# Altium schematic sheet Amp_op.SchDoc
size A0; SheetNumber: 4; SheetTotal: 4
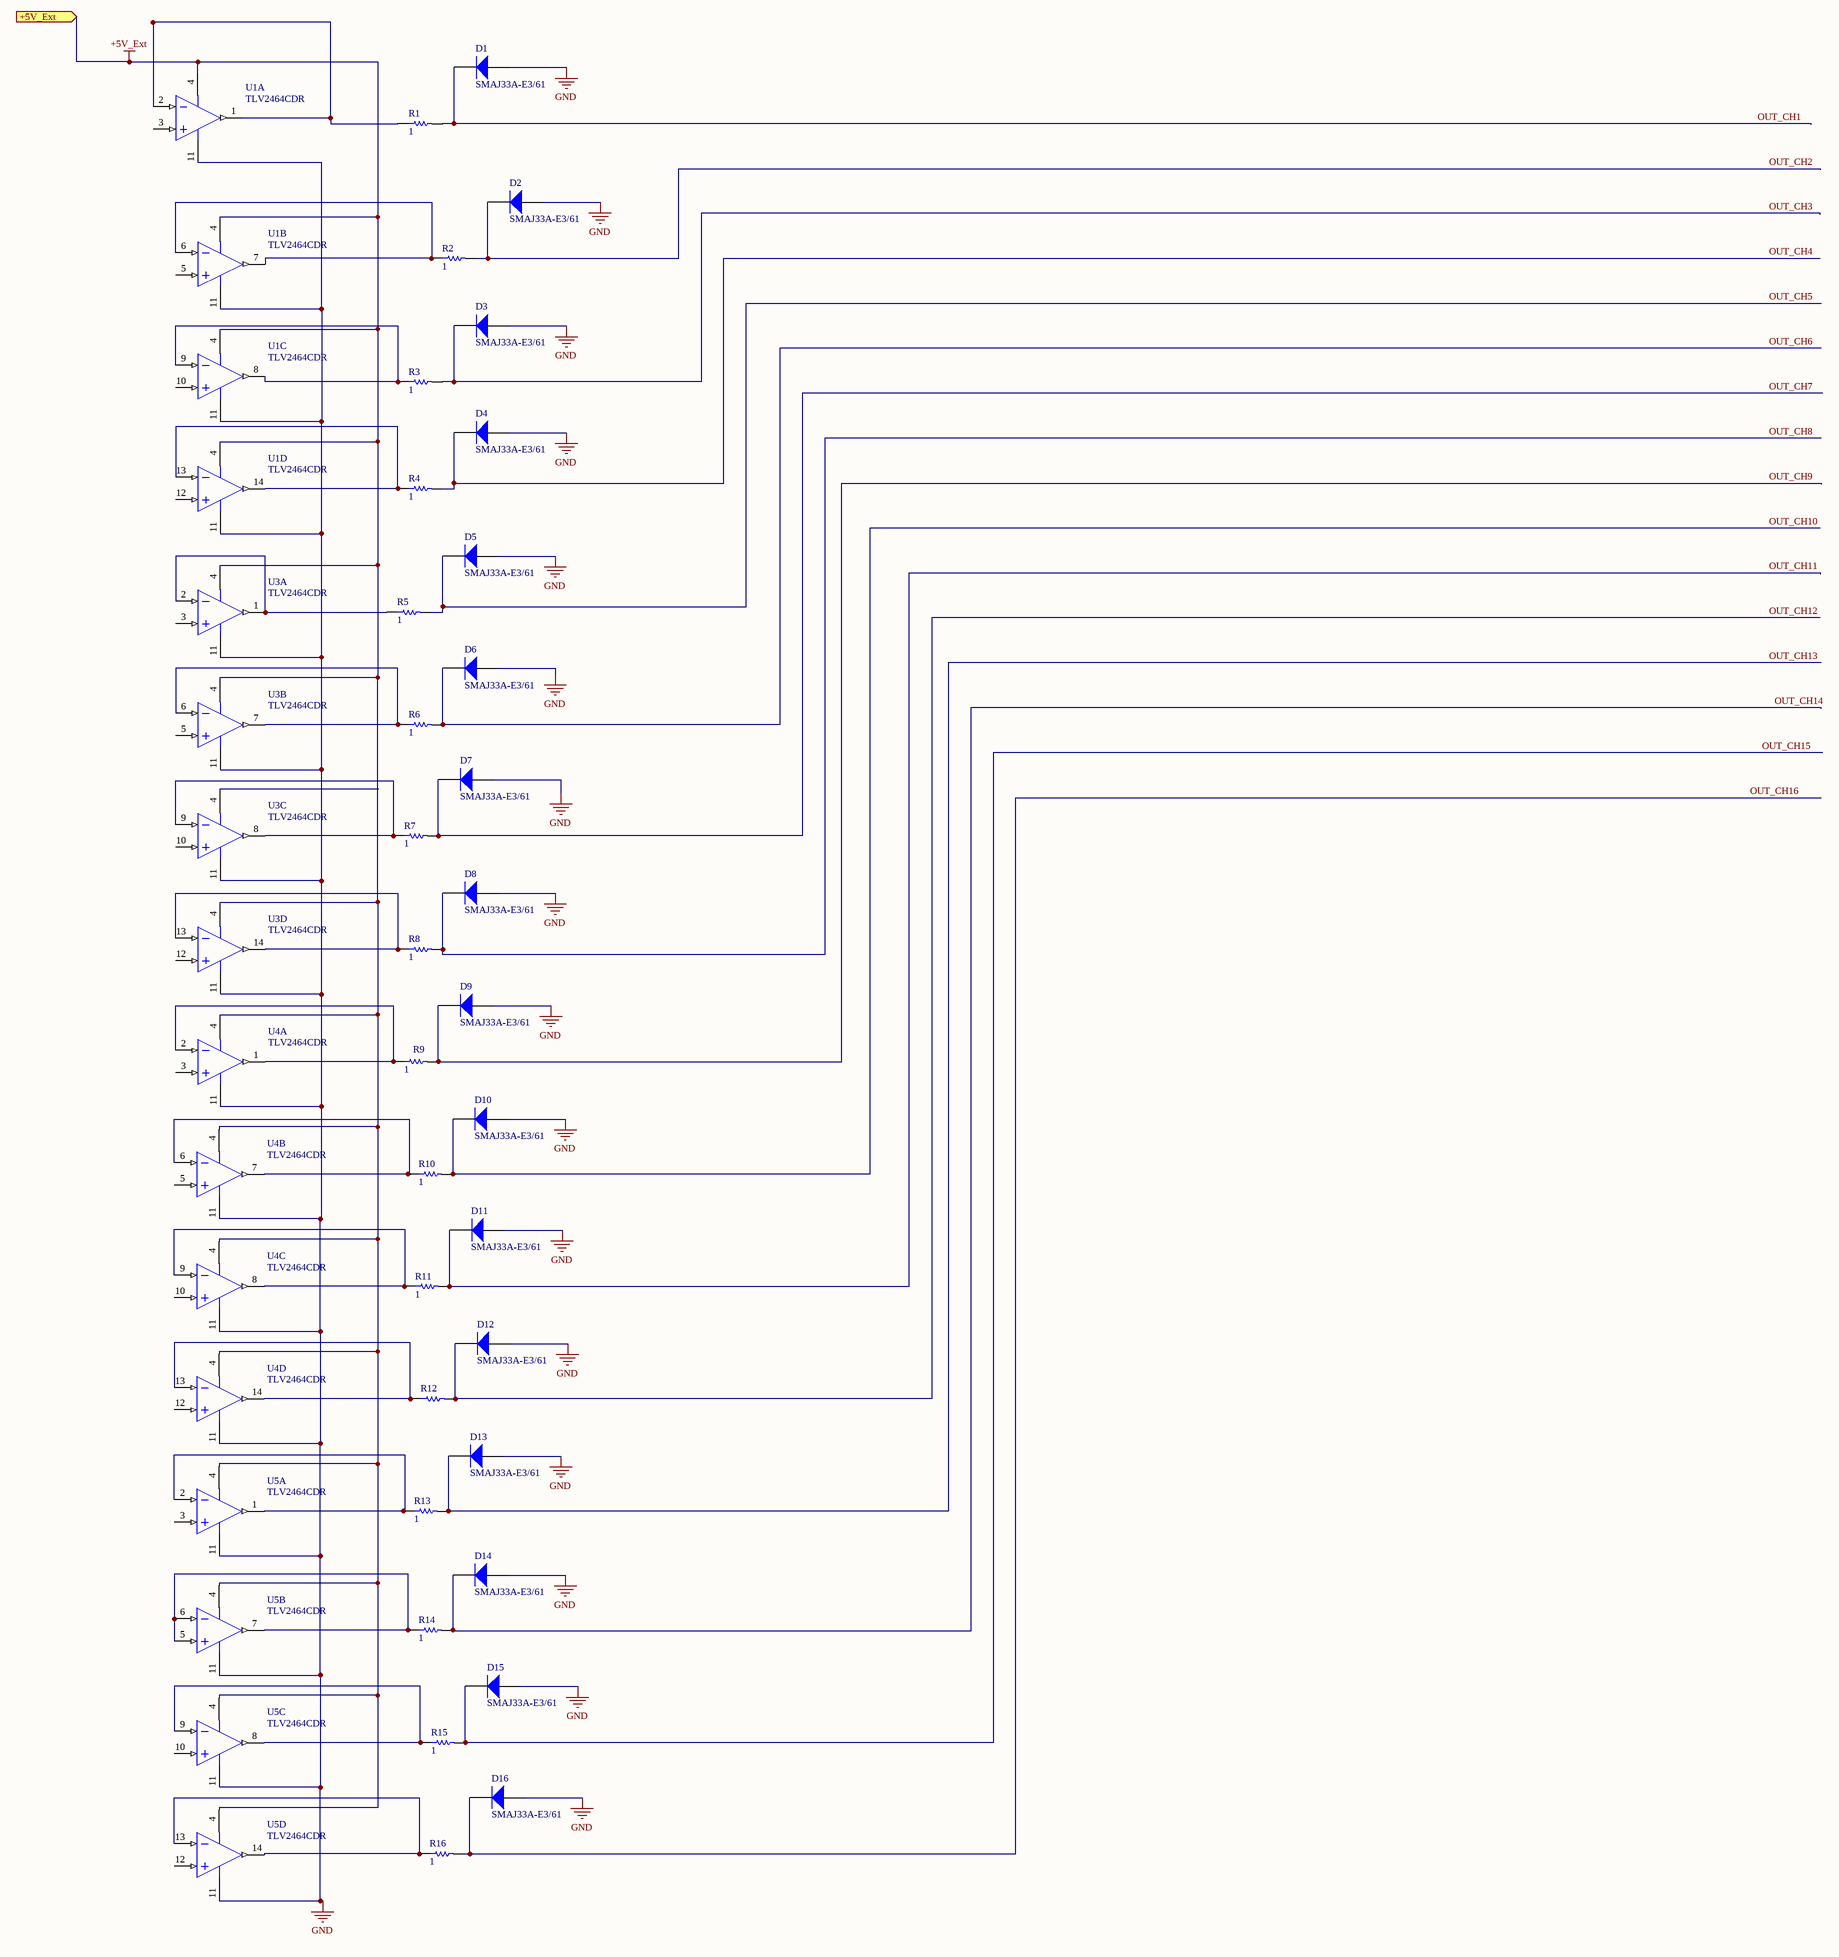
[diagram p0: Amp_op.SchDoc]

## Parts
D1  SMAJ33A-E3/61  [VISH-DO-214AC-2_L]
D2  SMAJ33A-E3/61  [VISH-DO-214AC-2_L]
D3  SMAJ33A-E3/61  [VISH-DO-214AC-2_L]
D4  SMAJ33A-E3/61  [VISH-DO-214AC-2_L]
D5  SMAJ33A-E3/61  [VISH-DO-214AC-2_L]
D6  SMAJ33A-E3/61  [VISH-DO-214AC-2_L]
D7  SMAJ33A-E3/61  [VISH-DO-214AC-2_L]
D8  SMAJ33A-E3/61  [VISH-DO-214AC-2_L]
D9  SMAJ33A-E3/61  [VISH-DO-214AC-2_L]
D10  SMAJ33A-E3/61  [VISH-DO-214AC-2_L]
D11  SMAJ33A-E3/61  [VISH-DO-214AC-2_L]
D12  SMAJ33A-E3/61  [VISH-DO-214AC-2_L]
D13  SMAJ33A-E3/61  [VISH-DO-214AC-2_L]
D14  SMAJ33A-E3/61  [VISH-DO-214AC-2_L]
D15  SMAJ33A-E3/61  [VISH-DO-214AC-2_L]
D16  SMAJ33A-E3/61  [VISH-DO-214AC-2_L]
R1  value 1  (hidden comment: Resistor)
R2  value 1  (hidden comment: Resistor)
R3  value 1  (hidden comment: Resistor)
R4  value 1  (hidden comment: Resistor)
R5  value 1  (hidden comment: Resistor)
R6  value 1  (hidden comment: Resistor)
R7  value 1  (hidden comment: Resistor)
R8  value 1  (hidden comment: Resistor)
R9  value 1  (hidden comment: Resistor)
R10  value 1  (hidden comment: Resistor)
R11  value 1  (hidden comment: Resistor)
R12  Resistor  (value not drawn)
R13  value 1  (hidden comment: Resistor)
R14  value 1  (hidden comment: Resistor)
R15  value 1  (hidden comment: Resistor)
R16  value 1  (hidden comment: Resistor)
U1  TLV2464CDR  [D0014A_N]  (parts A,B,C,D of 4)
U3  TLV2464CDR  [D0014A_N]  (parts A,B,C,D of 4)
U4  TLV2464CDR  [D0014A_N]  (parts A,B,C,D of 4)
U5  TLV2464CDR  [D0014A_N]  (parts A,B,C,D of 4)

## Ports
+5V_Ext (in)

## Nets
+5V_Ext: U1.4(VDD+) U3.4(VDD+) U4.4(VDD+) U5.4(VDD+) ; port +5V_Ext
GND: D1.2(A) D2.2(A) D3.2(A) D4.2(A) D5.2(A) D6.2(A) D7.2(A) D8.2(A) D9.2(A) D10.2(A) D11.2(A) D12.2(A) D13.2(A) D14.2(A) D15.2(A) D16.2(A) U3.11(GND) U4.11(GND) U5.11(GND)
OUT_CH1: D1.1(K) R1.2
OUT_CH2: D2.1(K) R2.2
OUT_CH3: D3.1(K) R3.2
OUT_CH4: D4.1(K) R4.2
OUT_CH5: D5.1(K) R5.2
OUT_CH6: D6.1(K) R6.2
OUT_CH7: D7.1(K) R7.2
OUT_CH8: D8.1(K) R8.2
OUT_CH9: D9.1(K) R9.2
OUT_CH10: D10.1(K) R10.2
OUT_CH11: D11.1(K) R11.2
OUT_CH12: D12.1(K) R12.2
OUT_CH13: D13.1(K) R13.2
OUT_CH14: D14.1(K) R14.2
OUT_CH15: D15.1(K) R15.2
OUT_CH16: D16.1(K) R16.2
NetR1_1: R1.1 U1.1(OUT1) U1.2(IN1-)
NetR2_1: R2.1 U1.6(IN2-) U1.7(OUT2)
NetR3_1: R3.1 U1.8(OUT3) U1.9(IN3-)
NetR4_1: R4.1 U1.13(IN4-) U1.14(OUT4)
NetR5_1: R5.1 U3.1(OUT1) U3.2(IN1-)
NetR6_1: R6.1 U3.6(IN2-) U3.7(OUT2)
NetR7_1: R7.1 U3.8(OUT3) U3.9(IN3-)
NetR8_1: R8.1 U3.13(IN4-) U3.14(OUT4)
NetR9_1: R9.1 U4.1(OUT1) U4.2(IN1-)
NetR10_1: R10.1 U4.6(IN2-) U4.7(OUT2)
NetR11_1: R11.1 U4.8(OUT3) U4.9(IN3-)
NetR12_1: R12.1 U4.13(IN4-) U4.14(OUT4)
NetR13_1: R13.1 U5.1(OUT1) U5.2(IN1-)
NetR14_1: R14.1 U5.5(IN2+) U5.6(IN2-) U5.7(OUT2)
NetR15_1: R15.1 U5.8(OUT3) U5.9(IN3-)
NetR16_1: R16.1 U5.13(IN4-) U5.14(OUT4)
NetU1_11: U1.11(GND) U3.11(GND)

Not connected (* = marked no-connect by the designer): U1 3(IN1+) 5(IN2+) 10(IN3+) 12(IN4+); U3 3(IN1+) 5(IN2+) 10(IN3+) 12(IN4+); U4 3(IN1+) 5(IN2+) 10(IN3+) 12(IN4+); U5 3(IN1+) 10(IN3+) 12(IN4+)

## Library data of the parts
D1-D16 = CMP-0548-00255-2: Transient Voltage Suppressor, 6.40 to 231 V, 33 V Stand-off Voltage, Uni-Directional, -55 to 155 degC, 2-pin DO-214AC, Pb-Free, Tape and Reel; Manufacturer: Vishay Semiconductor; VBR Uni-Directional (V): 6.4 to 231; ID (uA): 1; IFSM: 40 A; VWM (V): 33; PPPM (W): 400, 300; ComponentLink2Description: Datasheet; RoHS: TRUE; Mounting Technology: Surface Mount; ComponentLink2URL: http://www.vishay.com/docs/88390/smaj50a.pdf; PackageDescription: 2-Pin DO-214AC (SMA), Body 4.245 x 2.665 mm; PartNumber: SMAJ33A-E3/61; DatasheetVersion: 12/8/2013; ComponentLink1URL: http://www.vishay.com/; ComponentLink3Description: Package Specification; PackageReference: DO-214AC-2; ComponentLink3URL: http://www.vishay.com/docs/88390/smaj50a.pdf; ComponentLink1Description: Manufacturer URL; Operating Junction and Storage Temperature Range: -55 to 150 degC; Packing: Tape and Reel
R1-R16 = Resistor: TC1: 0; SimulationGenericComponent: True; TC2: 0
U1 U3-U5 = CMP-0271-00006-3: Quad Low Power, Rail-to-Rail Input / Output Operational Amplifier, 2.7 to 6 V, 0 to 70 degC, 14-pin SOIC (D14), Green (RoHS & no Sb/Br); Manufacturer: Texas Instruments; Offset Drift(Typ)(uV/C): 2; Total Supply Voltage(Min)(+5V is 5, +/-5V is 10): 2.7; IIB(Max)(pA): 14000; CMRR(Min)(dB): 66; Iq per channel(Max)(mA): 0.575; Vn at 1kHz(Typ)(nV/rtHz): 11; Slew Rate(Typ)(V/us): 1.6; Number of Channels: 4; Sub Family: High Output Current Amplifier (>=50mA), Low Supply Voltage Amplifier (<=2.7V), Precision Amplifier; Total Supply Voltage(Max)(+5V is 5, +/-5V is 10): 6; ComponentLink3URL: http://www.ti.com/lit/ml/mpds177g/mpds177g.pdf; ComponentLink1Description: Manufacturer URL; PackageReference: D0014A; Vio (25C)(Max)(mV): 2; Mounting Technology: Surface Mount; PackageDescription: 14-Pin Plastic Small Outline, Body 8.65 x 3.9 mm, Pitch 1.27 mm; ComponentLink2Description: Datasheet; ComponentLink3Description: Package Specification; ComponentLink1URL: http://www.ti.com/; DatasheetVersion: SLOS220J; PartNumber: TLV2464CDR; Code_JEDEC: MS-012; PackageVersion: 4040047-5/M, 06/2011; ComponentLink2URL: http://www.ti.com/general/docs/lit/getliterature.tsp?genericPartNumber=TLV2464&fileType=pdf; Eco-Plan: Green (RoHS & no Sb/Br)